# EAGLE design nRF-Serial-v12-Class-vrs (EAGLE 6.6.0)
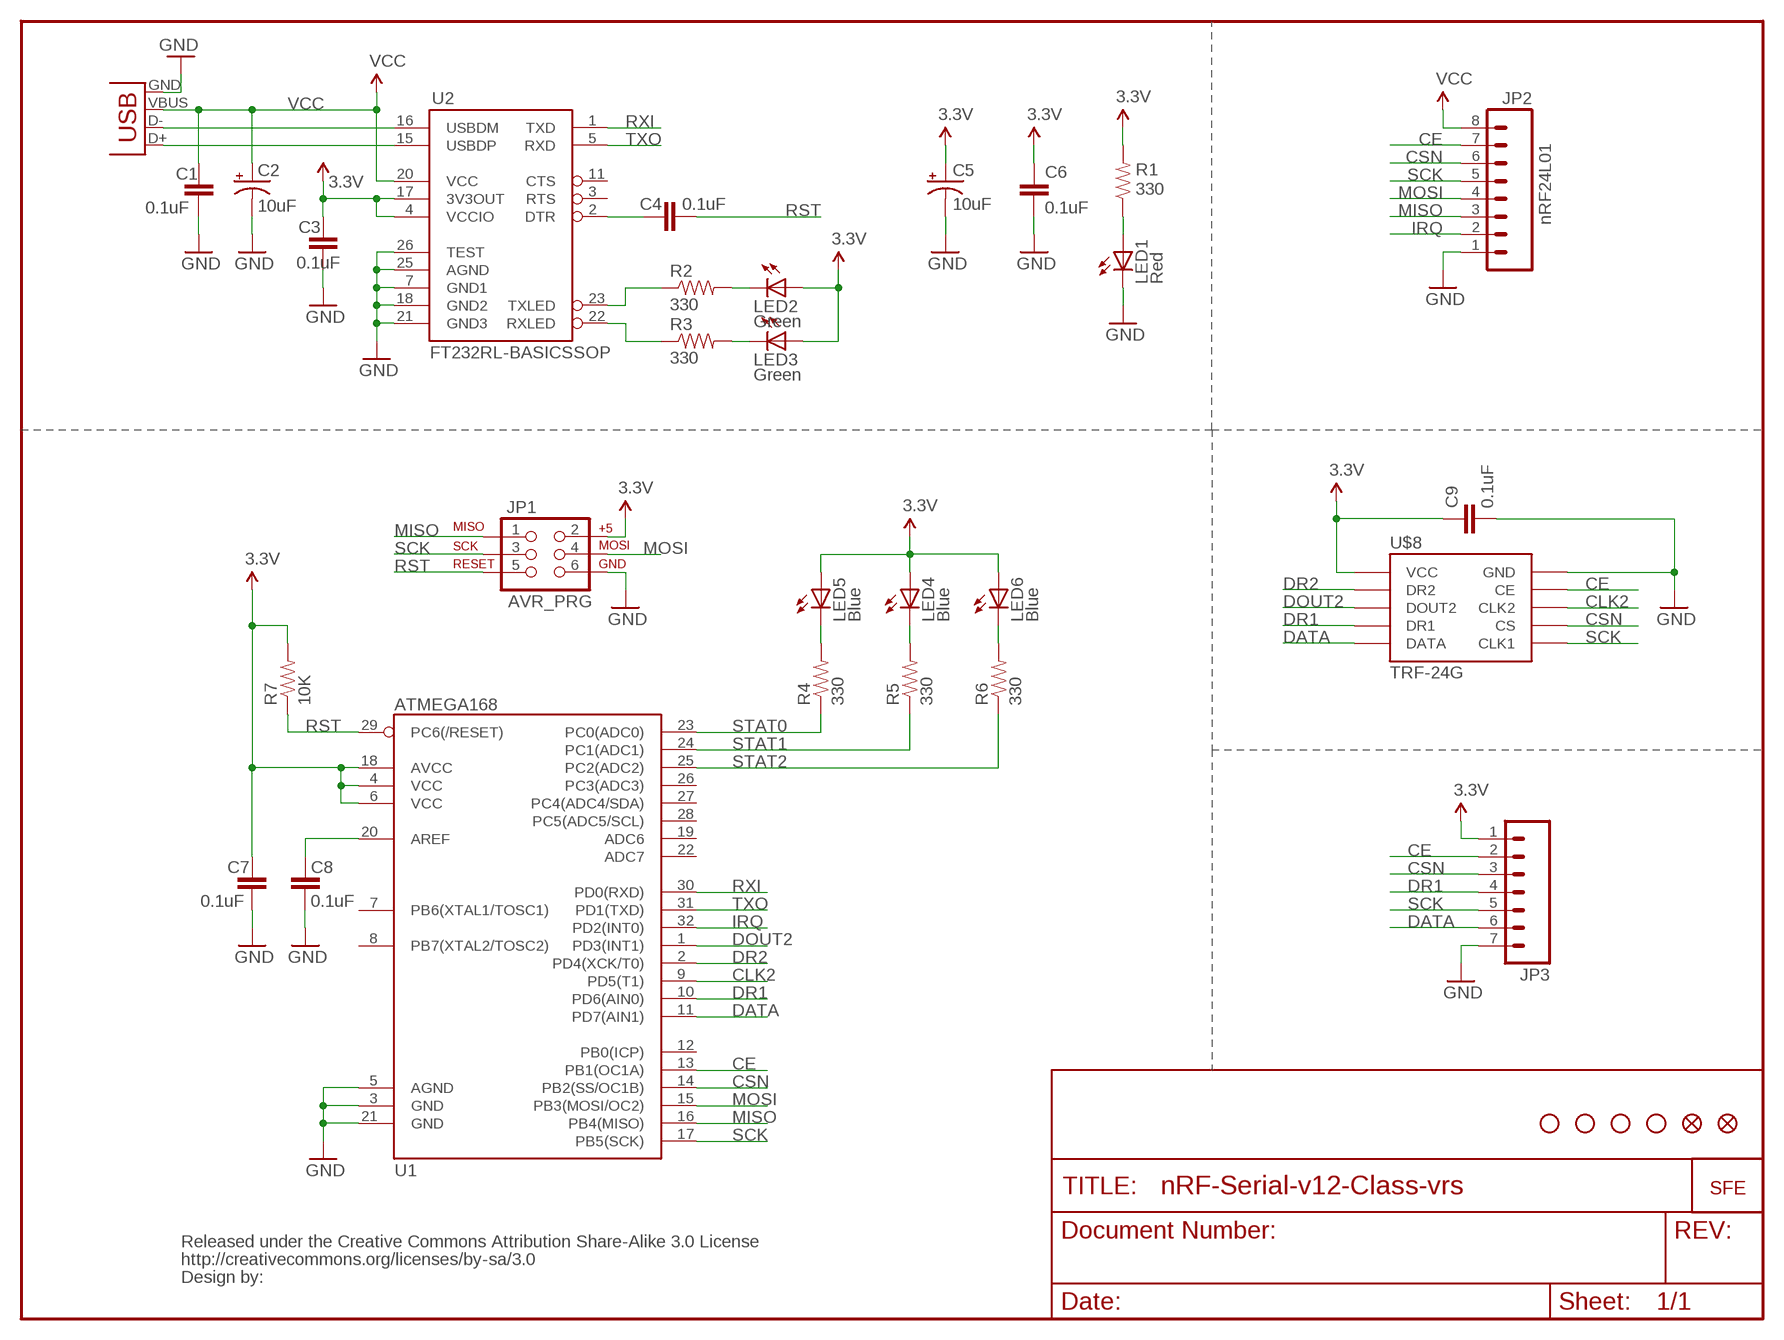
[diagram p0: schematic, sheet 1]

## Parts
C1  0.1uF  CAP0402  [C0402]
C2  10uF  CAP_POL1206  [EIA3216]
C3  0.1uF  CAP0402  [C0402]
C4  0.1uF  CAP0402  [C0402]
C5  10uF  CAP_POL1206  [EIA3216]
C6  0.1uF  CAP0402  [C0402]
C7  0.1uF  CAP0402  [C0402]
C8  0.1uF  CAP0402  [C0402]
C9  0.1uF  CAP0402  [C0402]
JP1  AVR_PRG  AVR_SPI_PRG_6PTH  [2X3]
JP2  nRF24L01  M08  [1X08]
JP3  M07  [1X07]
LED1  Red  LED0603  [LED-0603]
LED2  Green  LED0603  [LED-0603]
LED3  Green  LED0603  [LED-0603]
LED4  Blue  LED0603  [LED-0603]
LED5  Blue  LED0603  [LED-0603]
LED6  Blue  LED0603  [LED-0603]
R1  330  RESISTOR0402  [C0402]
R2  330  RESISTOR0402  [C0402]
R3  330  RESISTOR0402  [C0402]
R4  330  RESISTOR0402  [C0402]
R5  330  RESISTOR0402  [C0402]
R6  330  RESISTOR0402  [C0402]
R7  10K  RESISTOR0402  [C0402]
U1  ATMEGA168  [TQFP32-08]
U2  FT232RL-BASICSSOP  [SSOP28DB]
U$1  LOGO-SFENEW  [SFE-NEW-WEBLOGO]
U$2  FIDUCIAL1X2  [FIDUCIAL-1X2]
U$3  FIDUCIAL1X2  [FIDUCIAL-1X2]
U$4  STAND-OFF  [STAND-OFF]
U$5  STAND-OFF  [STAND-OFF]
U$6  STAND-OFF  [STAND-OFF]
U$7  STAND-OFF  [STAND-OFF]
U$8  TRF-24G  [TRF-24G-SOCKET]
U$9  CREATIVE_COMMONS  [CREATIVE_COMMONS]
X1  USBSMD  [USB-MINIB]

## Nets
3.3V: C3.1 C5.A(+) C6.1 C7.1 C9.1 JP1.2 JP3.1 LED2.A LED3.A LED4.A LED5.A LED6.A R1.2 R7.2 U1.4(VCC) U1.6(VCC) U1.18(AVCC) U2.4(VCCIO) U2.17(3V3OUT) U$8.P$1(VCC)
CE: JP2.7 JP3.2 U1.13(PB1(OC1A)) U$8.P$9(CE)
CLK2: U1.9(PD5(T1)) U$8.P$8(CLK2)
CSN: JP2.6 JP3.3 U1.14(PB2(SS/OC1B)) U$8.P$7(CS)
DATA: JP3.6 U1.11(PD7(AIN1)) U$8.P$5(DATA)
DOUT2: U1.1(PD3(INT1)) U$8.P$3(DOUT2)
DR1: JP3.4 U1.10(PD6(AIN0)) U$8.P$4(DR1)
DR2: U1.2(PD4(XCK/T0)) U$8.P$2(DR2)
GND: C1.2 C2.C(-) C3.2 C5.C(-) C6.2 C7.2 C8.1 C9.2 JP1.6 JP2.1 JP3.7 LED1.C U1.3(GND) U1.5(AGND) U1.21(GND) U2.7(GND1) U2.18(GND2) U2.21(GND3) U2.25(AGND) U2.26(TEST) U$8.P$10(GND) X1.GND
IRQ: JP2.2 U1.32(PD2(INT0))
MISO: JP1.1 JP2.3 U1.16(PB4(MISO))
MOSI: JP1.4 JP2.4 U1.15(PB3(MOSI/OC2))
N$1: C8.2 U1.20(AREF)
N$2: C4.2 U2.2(DTR)
N$3: R2.1 U2.23(TXLED)
N$4: R3.1 U2.22(RXLED)
N$5: LED3.C R3.2
N$6: LED2.C R2.2
N$9: LED5.C R4.2
N$10: LED4.C R5.2
N$11: LED6.C R6.2
N$12: LED1.A R1.1
N$16: U2.16(USBDM) X1.D-
N$17: U2.15(USBDP) X1.D+
RST: C4.1 JP1.5 R7.1 U1.29(PC6(/RESET))
RXI: U1.30(PD0(RXD)) U2.1(TXD)
SCK: JP1.3 JP2.5 JP3.5 U1.17(PB5(SCK)) U$8.P$6(CLK1)
STAT0: R4.1 U1.23(PC0(ADC0))
STAT1: R5.1 U1.24(PC1(ADC1))
STAT2: R6.1 U1.25(PC2(ADC2))
TXO: U1.31(PD1(TXD)) U2.5(RXD)
VCC: C1.1 C2.A(+) JP2.8 U2.20(VCC) X1.VBUS
Unconnected: U1.7(PB6(XTAL1/TOSC1)) U1.8(PB7(XTAL2/TOSC2)) U1.12(PB0(ICP)) U1.19(ADC6) U1.22(ADC7) U1.26(PC3(ADC3)) U1.27(PC4(ADC4/SDA)) U1.28(PC5(ADC5/SCL)) U2.3(RTS) U2.11(CTS)

## Library data of the parts
C1 C3 C4 C6-C9 = SparkFun:CAP: Capacitor Standard 0603 ceramic capacitor, and 0.1" leaded capacitor.
C2 C5 = SparkFun:CAP_POL: Capacitor Polarized These are standard SMD and PTH capacitors. Normally 10uF, 47uF, and 100uF in electrolytic and tantalum varieties. Always verify the external diameter of the through hole cap, it varies with capacity, voltage, and manufacturer. The EIA devices should be standard.
JP1 = SparkFun:AVR_SPI_PRG_6: AVR ISP 6 Pin This is the reduced ISP connector for AVR programming. Common on Arduino. This footprint will take up less PCB space and can be used with a 10-pin to 6-pin adapter such as SKU: BOB-08508
JP2 = SparkFun:M08: Header 8 Standard 8-pin 0.1" header. Use with straight break away headers (SKU : PRT-00116), right angle break away headers (PRT-00553), swiss pins (PRT-00743), machine pins (PRT-00117), and female headers (PRT-00115).
JP3 = SparkFun:M07: Header 7 Standard 7-pin 0.1" header. Use with straight break away headers (SKU : PRT-00116), right angle break away headers (PRT-00553), swiss pins (PRT-00743), machine pins (PRT-00117), and female headers (PRT-00115). NOTES ON THE VARIANTS LOCK and LOCK_LONGPADS... This footprint was designed to help hold the alignment of a through-hole component (i.e. 7-pin header) while soldering it into place. You may notice that each hole has been shifted either up or down by 0.005 of an inch from it's more standard position (which is usually a perfectly straight line). This slight alteration caused the pins (the squares in the middle) to touch the edges of the holes. Because they are alternating, it causes a "brace" to hold the header in place. 0.005 has proven to be the perfect amount of "off-center" position when using our standard breakaway headers. Although looks a little odd when you look at the bare footprint, once you have a header in there, the alteration is very hard to notice. Also, if you push a header all the way into place, it is covered up entirely on the bottom side. This idea of altering the position of holes to aid alignment will be further integrated into the Sparkfun Library for other footprints. It can help hold any component with 3 or more connection pins.
LED1-LED6 = SparkFun:LED: LEDs Standard schematic elements and footprints for 5mm, 3mm, 1206, and 0603 sized LEDs. 5mm - Spark Fun Electronics SKU : COM-00529 (and others)
R1-R7 = SparkFun:RESISTOR: Resistor Basic schematic elements and footprints for 0603, 1206, and PTH 1/10th watt (small) resistors.
U1 = SparkFun:ATMEGA168
U2 = SparkFun:FT232RL-BASIC: USB UART This is the simplified version of the FT232RL unit. Only what you need, nothing you don't. Spark Fun Electronics SKU : COM-00650
U$1 = SparkFun:LOGO-SFE: Spark Fun Electronics PCB Logo This is the standard Spark Fun Electronics PCB logo.
U$2 U$3 = SparkFun:FIDUCIAL: Fiducial Alignment Points Various fiducial points for machine vision alignment.
U$4-U$7 = SparkFun:STAND-OFF: Stand Off This is the mechanical footprint for a #4 phillips button head screw. Use the keepout ring to avoid running the screw head into surrounding components. SKU : PRT-00447
U$8 = SparkFun:TRF-24G
U$9 = SparkFun:CREATIVE_COMMONS
X1 = SparkFun:USB: USB Connectors USB-B-PTH is fully proven SKU : PRT-00139 USB-miniB is fully proven SKU : PRT-00587 USB-A-PCB is untested. USB-A-H is throughly reviewed, but untested. Spark Fun Electronics SKU : PRT-00437 USB-B-SMT is throughly reviewed, but untested. Needs silkscreen touching up. USB-A-S has not been used/tested USB-MB-H has not been used/tested

## Net classes
1 vcc: width 0.305 mm
2 gnd: width 0.203 mm

## Board
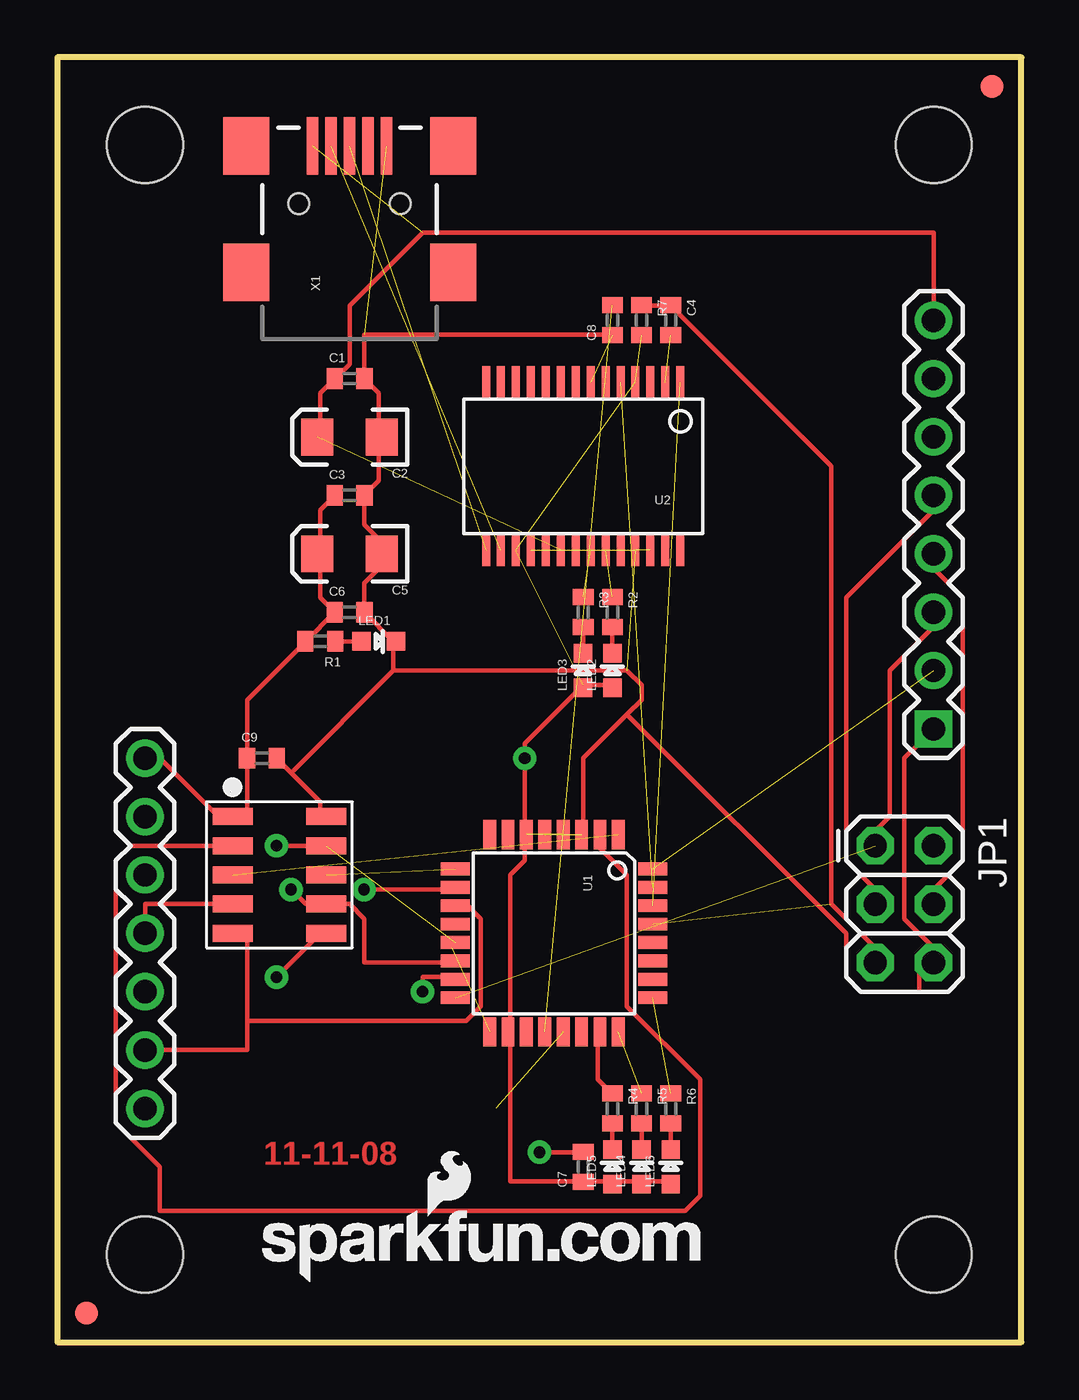
[diagram p1: board, top side]
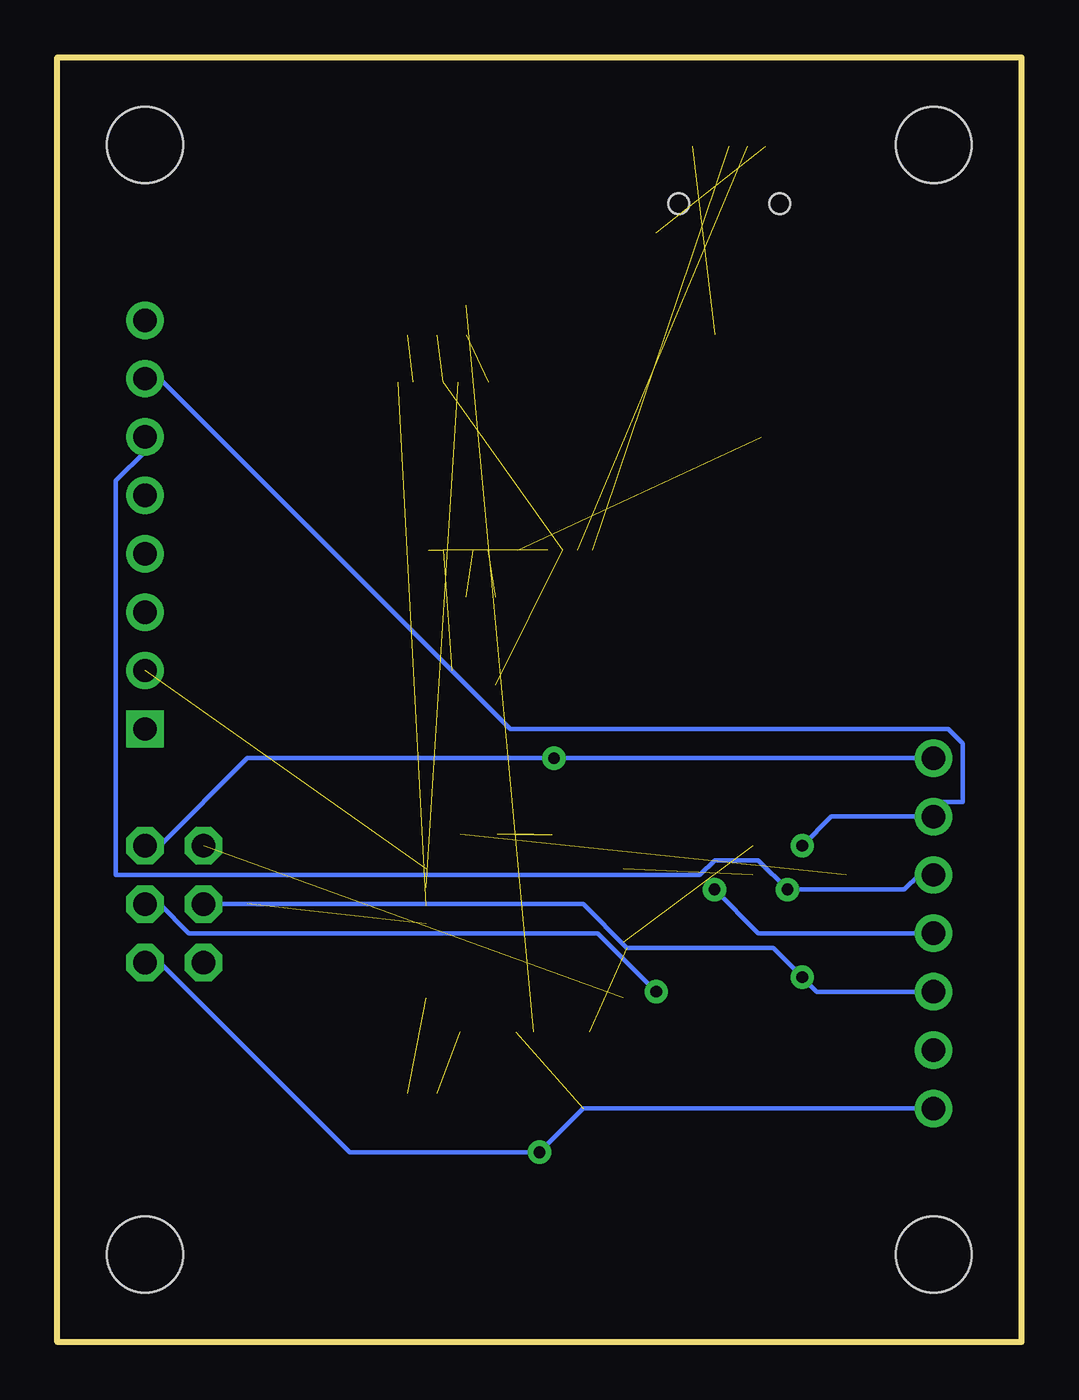
[diagram p2: board, bottom side, seen from below]

Size 41.91 x 55.88 mm. Coordinates in mm from the lower left corner, seen from the top.
Outline: 0,0 41.91,0 41.91,55.88 0,55.88 0,0
Copper layers (1*16): Top 0.035mm / dielectric 1.5mm / Bottom 0.035mm
Design rules "default": minimum track width 8mil, minimum drill 20mil, track to track 8mil, track to pad 8mil, pad to pad 8mil, via to via 8mil, smd to smd 8mil, copper to edge 10mil, drill to drill 8mil, minimum pad ring 12mil, minimum via ring 10mil, stop-mask expansion 4mil, vias tented up to drill 25mil, thermal gap 10mil

### Footprints (pad centres in the part's own frame; a part is rotated, then mirrored left to right if it is on the bottom)
C0402 = smd 0.7 x 0.9: 1 -0.65,0; 2 0.65,0
EIA3216 = smd 1.4 x 1.6: A 1.4,0; C -1.4,0
2X3 = drill 1.016 octagon: 1 0,0; 2 0,2.54; 3 2.54,0; 4 2.54,2.54; 5 5.08,0; 6 5.08,2.54
1X08 = drill 1.016 square: 1 0,0 | drill 1.016: 2 2.54,0; 3 5.08,0; 4 7.62,0; 5 10.16,0; 6 12.7,0; 7 15.24,0; 8 17.78,0
1X07 = drill 1.016: 1 0,0; 2 2.54,0; 3 5.08,0; 4 7.62,0; 5 10.16,0; 6 12.7,0; 7 15.24,0
LED-0603 = smd 0.8 x 0.8: A 0,-0.75; C 0,0.75
TQFP32-08 = smd 1.27 x 0.559: 1 -4.293,2.8; 2 -4.293,2; 3 -4.293,1.2; 4 -4.293,0.4; 5 -4.293,-0.4; 6 -4.293,-1.2; 7 -4.293,-2; 8 -4.293,-2.8; 17 4.293,-2.8; 18 4.293,-2; 19 4.293,-1.2; 20 4.293,-0.4; 21 4.293,0.4; 22 4.293,1.2; 23 4.293,2; 24 4.293,2.8 | smd 0.559 x 1.27: 9 -2.8,-4.293; 10 -2,-4.293; 11 -1.2,-4.293; 12 -0.4,-4.293; 13 0.4,-4.293; 14 1.2,-4.293; 15 2,-4.293; 16 2.8,-4.293; 25 2.8,4.293; 26 2,4.293; 27 1.2,4.293; 28 0.4,4.293; 29 -0.4,4.293; 30 -1.2,4.293; 31 -2,4.293; 32 -2.8,4.293
SSOP28DB = smd 0.348 x 1.397: 1 -4.225,-3.656; 2 -3.575,-3.656; 3 -2.925,-3.656; 4 -2.275,-3.656; 5 -1.625,-3.656; 6 -0.975,-3.656; 7 -0.325,-3.656; 8 0.325,-3.656; 9 0.975,-3.656; 10 1.625,-3.656; 11 2.275,-3.656; 12 2.925,-3.656; 13 3.575,-3.656; 14 4.225,-3.656; 15 4.225,3.656; 16 3.575,3.656; 17 2.925,3.656; 18 2.275,3.656; 19 1.625,3.656; 20 0.975,3.656; 21 0.325,3.656; 22 -0.325,3.656; 23 -0.975,3.656; 24 -1.625,3.656; 25 -2.275,3.656; 26 -2.925,3.656; 27 -3.575,3.656; 28 -4.225,3.656
FIDUCIAL-1X2 = smd 1 x 1: 1 0,0
STAND-OFF = hole 3.302: 0,0
TRF-24G-SOCKET = smd 0.74 x 1.727: P$1 0,0; P$2 1.27,0; P$3 2.54,0; P$4 3.81,0; P$5 5.08,0; P$6 5.08,4.064; P$7 3.81,4.064; P$8 2.54,4.064; P$9 1.27,4.064; P$10 0,4.064
USB-MINIB = smd 2.5 x 0.5: D+ 2.5,0; D- 2.5,0.8; GND 2.5,-1.6; ID 2.5,-0.8; VBUS 2.5,1.6 | smd 2.5 x 2: GND@1 -3,-4.5; GND@2 -3,4.5; GND@3 2.5,4.5; GND@4 2.5,-4.5 | hole 0.9: 0,2.2; 0,-2.2

### Placement (x,y rotation side)
C1  12.7,41.91 0 top
C2  12.7,39.37 180 top
C3  12.7,36.83 0 top
C4  26.67,44.45 270 top
C5  12.7,34.29 180 top
C6  12.7,31.75 0 top
C7  22.86,7.62 90 top
C8  24.13,44.45 90 top
C9  8.89,25.4 0 top
JP1  35.56,21.59 270 top
JP2  38.1,26.67 90 top
JP3  3.81,25.4 270 top
LED1  13.97,30.48 270 top
LED2  24.13,29.21 0 top
LED3  22.86,29.21 0 top
LED4  25.4,7.62 0 top
LED5  24.13,7.62 0 top
LED6  26.67,7.62 0 top
R1  11.43,30.48 180 top
R2  24.13,31.75 270 top
R3  22.86,31.75 270 top
R4  24.13,10.16 270 top
R5  25.4,10.16 270 top
R6  26.67,10.16 270 top
R7  25.4,44.45 270 top
U1  21.59,17.78 270 top
U2  22.86,38.1 180 top
U$1  8.89,2.6 0 top
U$2  1.27,1.27 0 top
U$3  40.64,54.61 0 top
U$4  3.81,3.81 0 top
U$5  38.1,52.07 0 top
U$6  3.81,52.07 0 top
U$7  38.1,3.81 0 top
U$8  7.62,22.86 270 top
U$9  -5.08,2.54 90 top  (outside the outline)
X1  12.7,49.53 90 top

### Tracks (layer width: path | path; a pad name or v marks a point on that pad's centre or on a via)
3.3V  (via drill 0.51)  (4 unrouted)
  Top 0.203: 22.86,6.99 24.13,6.99 | 24.13,6.99 LED5.A 24.13,6.99 | 22.86,6.99 C7.1 22.86,6.99 | 24.13,6.99 25.4,6.99 | 25.4,6.99 LED4.A 25.4,6.99 | 25.4,6.99 26.67,6.99 LED6.A | 22.86,28.57 24.13,28.57 LED2.A | 22.86,28.57 LED3.A 22.86,28.57 | 22.86,28.57 20.32,26.04 v20.32,25.4 20.32,22.23 U1.6 20.32,21.59 20.32,20.95 19.68,20.32 19.68,13.97 U1.18 19.68,13.34 19.68,6.99 22.86,6.99 | 10.79,30.48 12.06,31.75 | 10.79,30.48 R1.2 10.79,30.48 | 12.06,31.75 C6.1 12.06,31.75 | C3.1 12.06,36.83 11.43,36.2 11.43,34.92 C5.A 11.43,33.66 11.43,32.38 12.06,31.75 | 8.26,25.4 8.26,22.86 U$8.P$1 6.99,22.86 4.45,25.4 JP3.1 | 8.26,25.4 C9.1 8.26,25.4 | 10.79,30.48 8.26,27.94 8.26,25.4
  Bottom 0.203: JP1.2 37.47,21.59 33.66,25.4 v20.32,25.4 4.45,25.4 JP3.1
CE  (via drill 0.51)  (1 unrouted)
  Top 0.203: v9.53,21.59 11.43,21.59 U$8.P$9
  Bottom 0.203: v9.53,21.59 8.26,22.86 4.45,22.86 JP3.2 3.81,23.5 2.54,23.5 2.54,26.04 3.17,26.67 22.23,26.67 37.47,41.91 JP2.7
CLK2  (1 unrouted)
CSN  (via drill 0.51)
  Top 0.203: U1.14 17.14,16.51 13.34,16.51 13.34,18.41 12.7,19.05 12.06,19.05 U$8.P$7 11.43,19.05 10.79,19.05 v10.16,19.68
  Bottom 0.203: JP3.3 4.45,20.32 5.08,19.68 v10.16,19.68 11.43,20.95 13.34,20.95 13.97,20.32 39.37,20.32 39.37,37.47 38.1,38.73 JP2.6
DATA
  Top 0.203: 8.26,13.97 17.78,13.97 18.41,14.61 18.41,18.41 17.78,19.05 U1.11 | 8.26,13.97 8.26,17.78 U$8.P$5 | 8.26,13.97 8.26,12.7 4.45,12.7 JP3.6
DOUT2  (1 unrouted)
DR1  (via drill 0.51)
  Top 0.203: v13.34,19.68 17.14,19.68 U1.10 | U$8.P$4 6.99,19.05 3.81,19.05 3.81,18.41 JP3.4
  Bottom 0.203: v13.34,19.68 11.43,17.78 4.45,17.78 JP3.4
DR2
  Top 0.203: U1.2 23.5,21.59 24.77,20.32 24.77,14.61 27.94,11.43 27.94,6.35 27.3,5.71 4.45,5.71 4.45,7.62 2.54,9.53 2.54,20.95 3.17,21.59 6.99,21.59 U$8.P$2
GND  (via drill 0.51)  (8 unrouted)
  Top 0.203: 13.34,36.83 13.97,37.47 13.97,38.73 C2.C 13.97,40.01 13.97,41.27 13.34,41.91 | 13.34,36.83 C3.2 13.34,36.83 | 13.34,41.91 C1.2 13.34,41.91 | 13.34,41.91 13.34,43.81 24.13,43.81 C8.1 | 13.34,36.83 13.34,35.56 13.97,34.92 C5.C 13.97,33.66 13.34,33.02 13.34,31.75 | 10.16,24.77 11.43,23.5 11.43,22.86 U$8.P$10 | 10.16,24.77 9.53,25.4 C9.2 | 14.61,30.48 13.34,31.75 | 14.61,30.48 LED1.C 14.61,30.48 | 13.34,31.75 C6.2 13.34,31.75 | 24.77,27.3 25.4,27.94 25.4,28.57 24.77,29.21 14.61,29.21 | 24.77,27.3 22.86,25.4 22.86,22.23 U1.3 | 14.61,29.21 14.61,30.48 | 14.61,29.21 10.16,24.77 | JP2.1 37.47,26.04 36.83,25.4 36.83,18.41 38.1,17.14 JP1.6 37.47,16.51 37.47,15.24 34.92,15.24 34.29,15.88 34.29,17.78 24.77,27.3 | v20.95,8.26 22.86,8.26 C7.2
  Bottom 0.203: JP3.7 4.45,10.16 19.05,10.16 v20.95,8.26 29.21,8.26 37.47,16.51 JP1.6
IRQ  (1 unrouted)
MISO  (1 unrouted)
  Top 0.203: JP1.1 35.56,22.23 36.2,22.86 36.2,29.21 38.1,31.11 JP2.3
MOSI  (via drill 0.51)
  Top 0.203: v15.88,15.24 15.88,15.88 17.14,15.88 U1.15 | JP2.4 38.1,33.66 39.37,32.38 39.37,20.95 38.1,19.68 JP1.4
  Bottom 0.203: v15.88,15.24 18.41,17.78 36.2,17.78 37.47,19.05 JP1.4
N$1  (1 unrouted)
N$2  (1 unrouted)
N$3  (1 unrouted)
N$4  (1 unrouted)
N$5
  Top 0.203: R3.2 22.86,31.11 R3.2 | LED3.C R3.2 | LED3.C 22.86,29.84 LED3.C
N$6
  Top 0.203: R2.2 24.13,31.11 R2.2 | LED2.C R2.2 | LED2.C 24.13,29.84 LED2.C
N$9
  Top 0.203: R4.2 24.13,9.53 R4.2 | LED5.C R4.2 | LED5.C 24.13,8.26 LED5.C
N$10
  Top 0.203: R5.2 25.4,9.53 R5.2 | LED4.C R5.2 | LED4.C 25.4,8.26 LED4.C
N$11
  Top 0.203: R6.2 26.67,9.53 R6.2 | LED6.C R6.2 | LED6.C 26.67,8.26 LED6.C
N$12
  Top 0.203: R1.1 12.06,30.48 R1.1 | R1.1 LED1.A | LED1.A 13.34,30.48 LED1.A
N$16  (1 unrouted)
N$17  (1 unrouted)
RST  (1 unrouted)
  Top 0.203: 26.67,45.09 25.4,45.09 R7.1 | 26.67,45.09 C4.1 26.67,45.09 | 26.67,45.09 33.66,38.1 33.66,19.05 35.56,17.14 JP1.5
RXI  (1 unrouted)
SCK  (via drill 0.51)  (1 unrouted)
  Top 0.203: v9.53,15.88 11.43,17.78 U$8.P$6 | JP1.3 35.56,19.68 34.29,20.95 34.29,32.38 38.1,36.2 JP2.5
  Bottom 0.203: JP3.5 4.45,15.24 8.89,15.24 v9.53,15.88 10.79,17.14 17.14,17.14 19.05,19.05 34.92,19.05 JP1.3
STAT0
  Top 0.203: R4.1 24.13,10.79 23.5,11.43 23.5,13.34 U1.23
STAT1  (1 unrouted)
STAT2  (1 unrouted)
TXO  (1 unrouted)
VCC  (2 unrouted)
  Top 0.203: 12.06,41.91 11.43,41.27 11.43,40.01 C2.A | 12.06,41.91 C1.1 12.06,41.91 | 12.06,41.91 12.7,42.55 12.7,45.09 15.88,48.26 38.1,48.26 38.1,45.09 JP2.8

### Text on the board
Top: 11-11-08
tPlace: Nordic USB Serial Converter | nRF24L01 | nRF2401A | VCC | GND | GND | 3.3V | 3.3V | STAT0 | STAT1 | STAT2 | POWER | TX | RX | RF-24G | P. Dokter
tValues: DNP